# Altium project PALHASERVO.PrjPcb
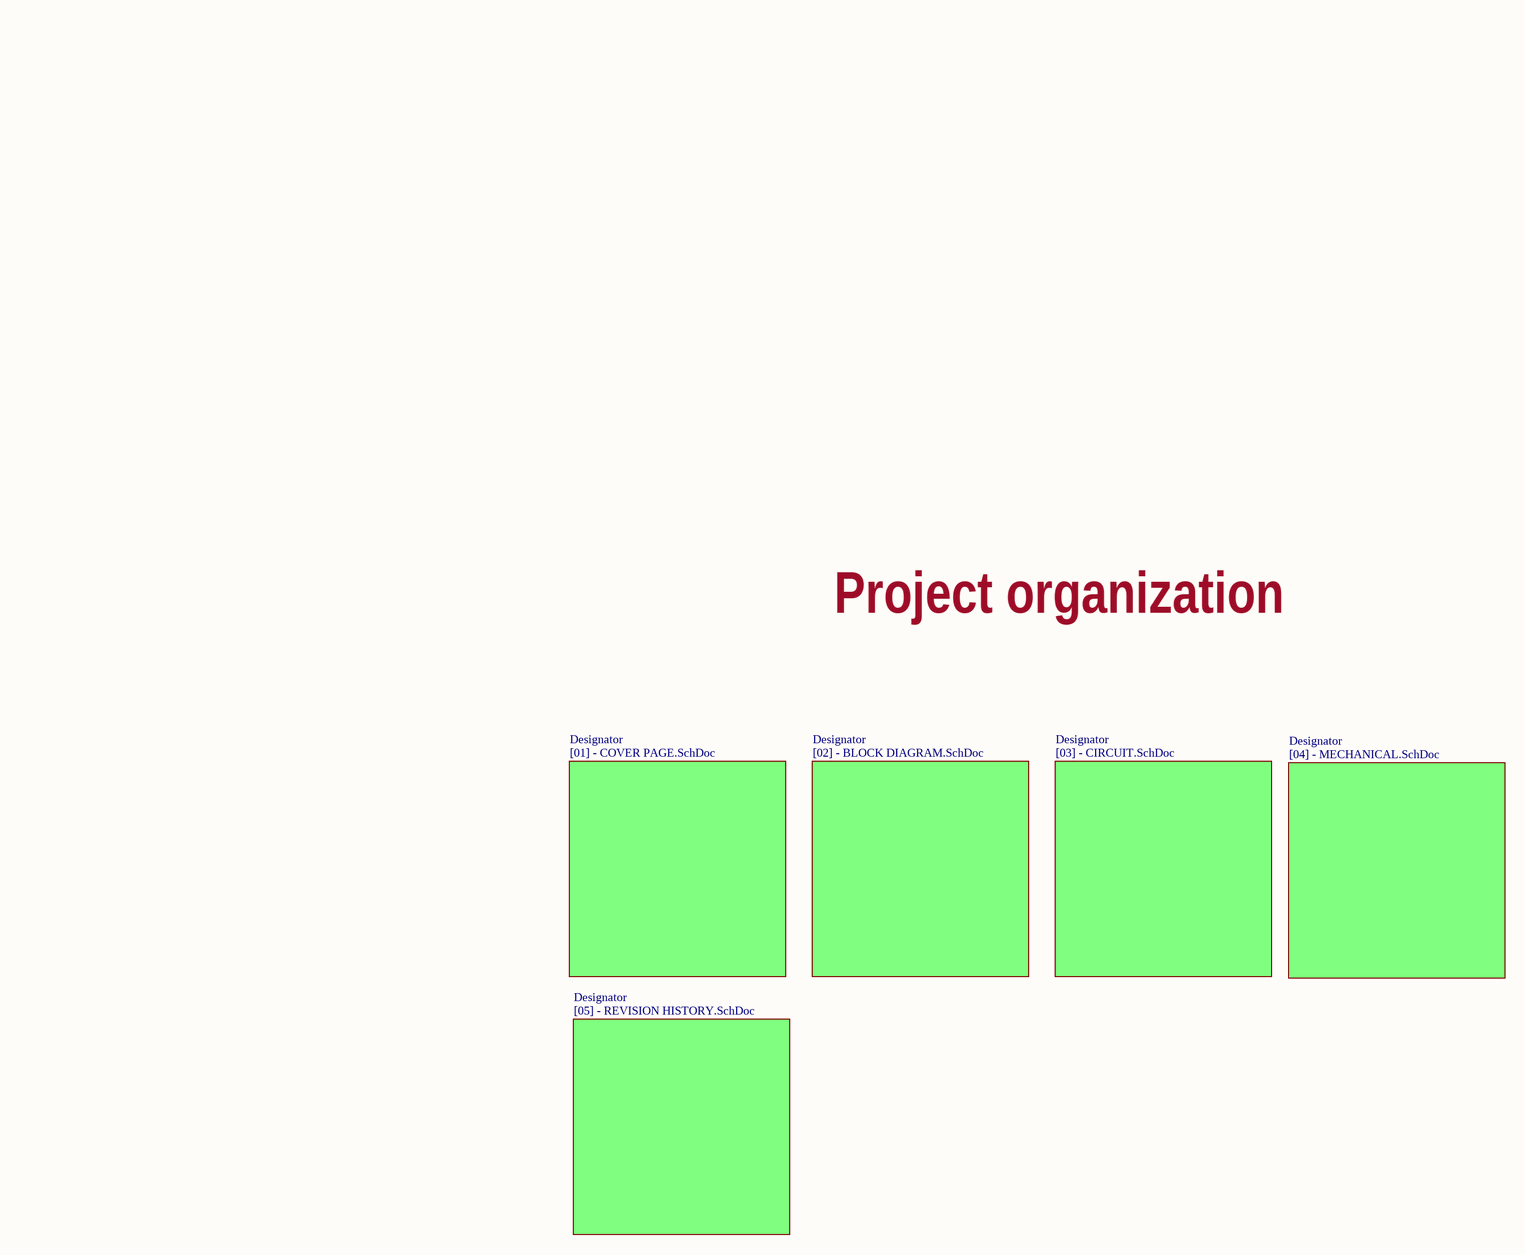
[diagram p0: PALHASERVO.SchDoc]
Assembly_Variant: Full; Currency: USD; EngineerName: Jpnbino; Project: Template Project; VersionRevision: V1I1
4 sheets, 25 parts. Net scope: global (net labels, ports and power ports of the same name join across sheets).
Board file: PALHASERVO.PcbDoc
Sheets:
  PALHASERVO.SchDoc
    Designator = [01] - COVER PAGE.SchDoc
    Designator = [03] - CIRCUIT.SchDoc
    Designator = [04] - MECHANICAL.SchDoc

## Sheet PALHASERVO.SchDoc
size A3; CompanyName: KDS; Engineer: João Paulo Nogueira Bino; Organization: KDS; DocumentNumber: 0; Revision: V1I1; SheetNumber: 0; SheetTotal: 6; PageSetup: Record=PageOptions|CenterHorizontal=True|CenterVertical=True|PrintScale=1.07|XCorrection=1.00|YCorrection=1.00|PrintKind=1|BorderSize=5000000|LeftOffset=0|BottomOffset=0|Orientation=2|PaperLength=1000|PaperWidth=1000|Scale=100|PaperSource=7|PrintQuality=600|MediaType=1|DitherType=10|PaperKind=A3|PrintScaleMode=1; ProjectName: KDS C6A816x Module

### Sub-sheets
Designator = [01] - COVER PAGE.SchDoc: no entries
Designator = [02] - BLOCK DIAGRAM.SchDoc (file not in this document): no entries
Designator = [03] - CIRCUIT.SchDoc: no entries
Designator = [04] - MECHANICAL.SchDoc: no entries
Designator = [05] - REVISION HISTORY.SchDoc (file not in this document): no entries

### Notes on the sheet
- Project organization
- Project:
- Revision:
- Engineer:
- Title:
- Embedded Things
- Date:
- Hour:
- Variant:

## Sheet [01] - COVER PAGE.SchDoc
size A3; DocumentNumber: 1; SheetNumber: 1; SheetTotal: 6
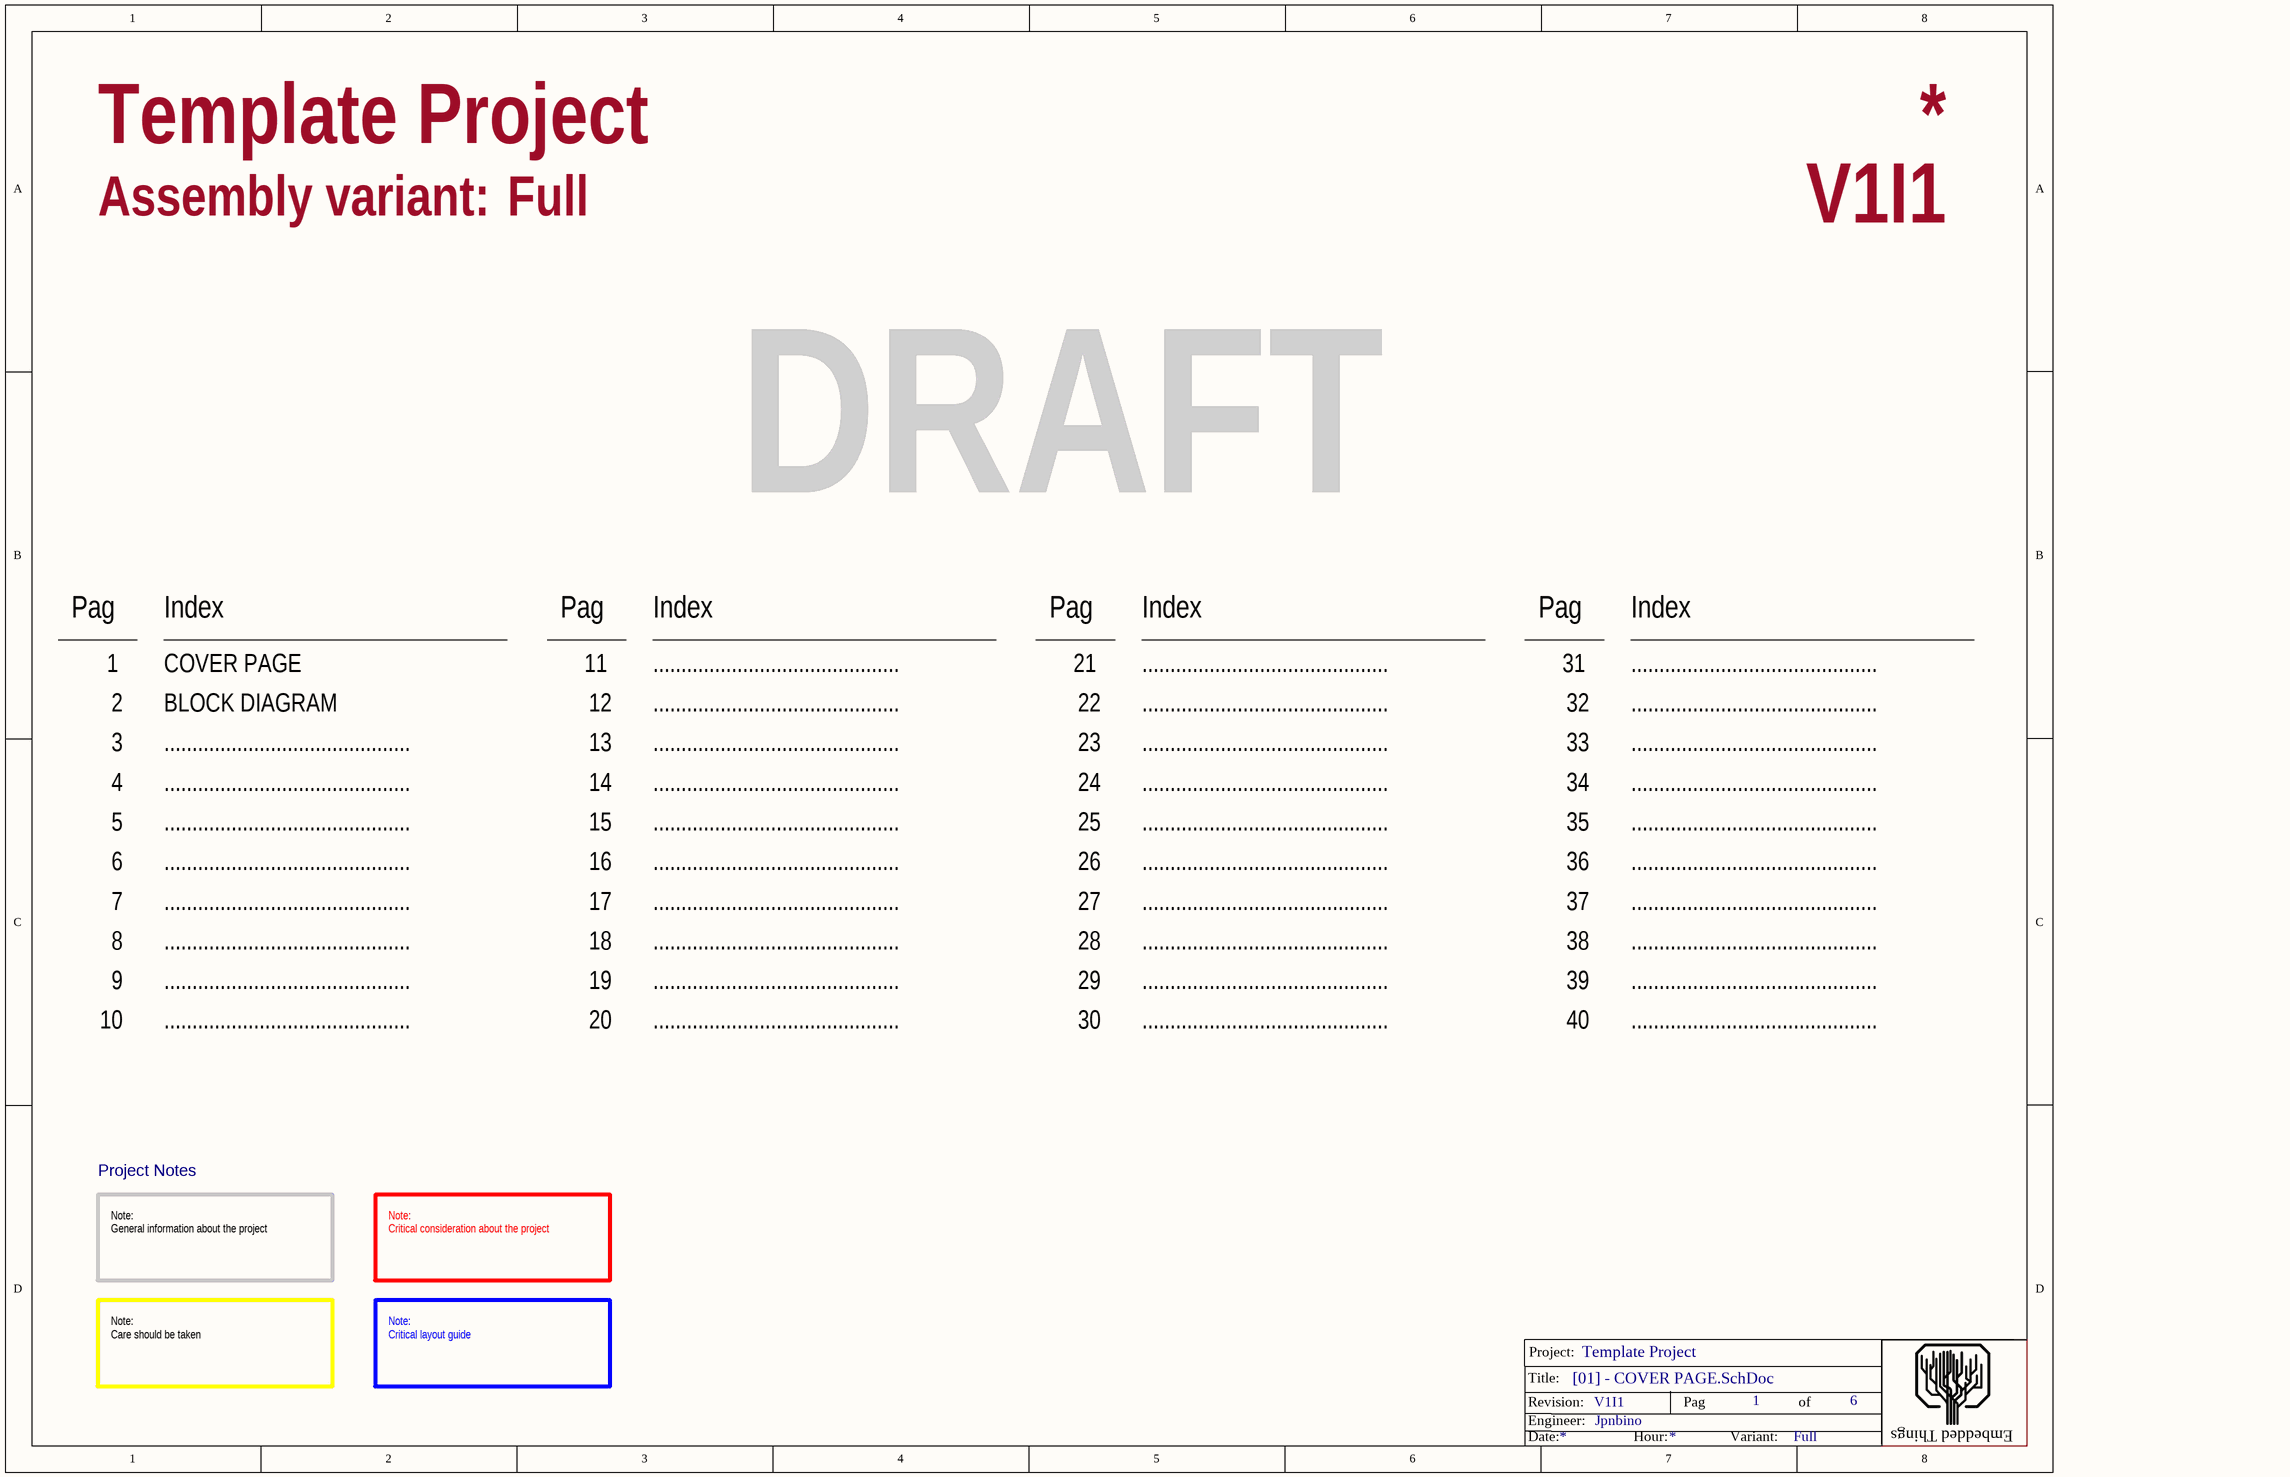
[diagram p1: [01] - COVER PAGE.SchDoc]

### Notes on the sheet
- Assembly variant:
- DRAFT
- Pag
- Index
- 1
- COVER PAGE
- 11
- ............................................
- 21
- 31
- 2
- 3
- BLOCK DIAGRAM
- 12
- 13
- 22
- 23
- 32
- 33
- 4
- 5
- 14
- 15
- 24
- 25
- 34
- 35
- 6
- 16
- 26
- 36
- 7
- 8
- 17
- 18
- 27
- 28
- 37
- 38
- 9
- 10
- 19
- 20
- 29
- 30
- 39
- 40
- Project Notes
- Note:
  General information about the project
- Note:
  Critical consideration about the project
- Note:
  Care should be taken
- Note:
  Critical layout guide
- Project:
- Revision:
- Engineer:
- Title:
- of
- Embedded Things
- Date:
- Hour:
- Variant:

## Sheet [03] - CIRCUIT.SchDoc
size A3; DocumentNumber: 3; SheetNumber: 3; SheetTotal: 6; PageSetup: Record=PageOptions|CenterHorizontal=True|CenterVertical=True|PrintScale=1.00|XCorrection=1.00|YCorrection=1.00|PrintKind=1|BorderSize=5000000|LeftOffset=0|BottomOffset=0|Orientation=2|PaperLength=1000|PaperWidth=1000|Scale=100|PaperSource=7|PrintQuality=-3|MediaType=1|DitherType=10|PrintScaleMode=1|PaperKind=A4|PaperIndex=9
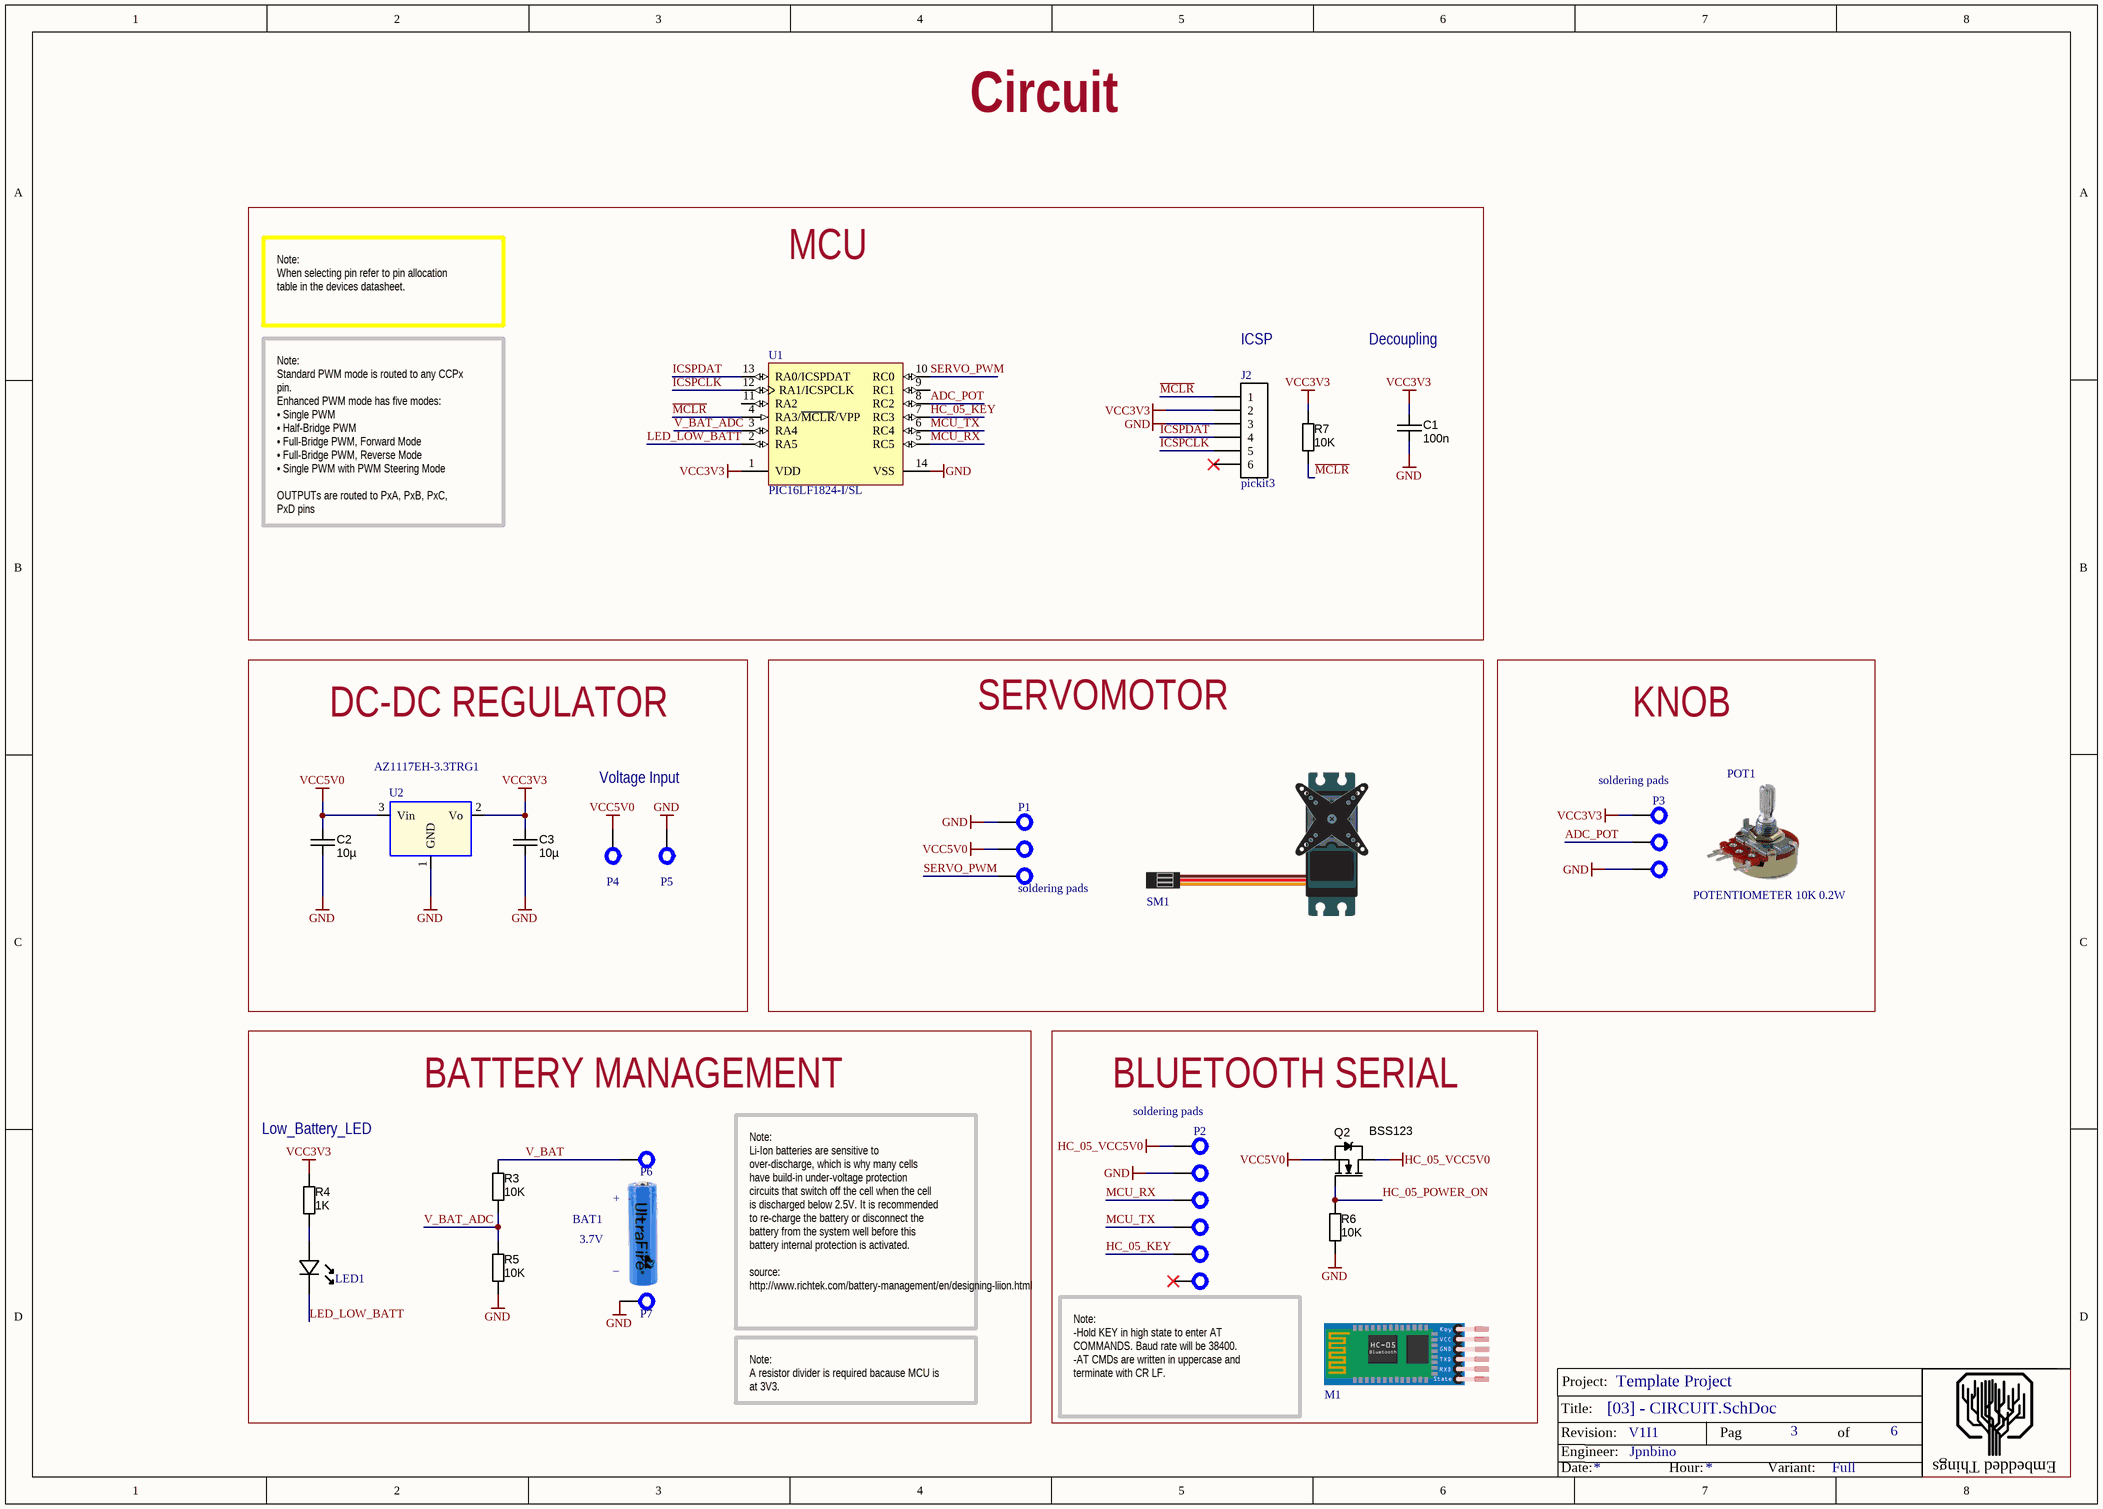
[diagram p2: [03] - CIRCUIT.SchDoc]

### Parts
BAT1  3.7V
C1  value 100n  [CAPC1608X90N]  (hidden comment: approved sub OK)
C2  value 10µ  [CAPC3216X180N]  (hidden comment: approved sub OK)
C3  value 10µ  [CAPC3216X180N]  (hidden comment: approved sub OK)
J2  pickit3  [CONN_ICSP]  (no BOM)
LED1  RED  [LED-0603-RED]  (value not drawn)
M1  MODULE HC-05  (value not drawn)
P1  type: soldering pads  [PAD_PTH 3 vias]  (hidden comment: 3)  (no BOM)
P2  type: soldering pads  [PAD_PTH 6 VIAS]  (hidden comment: 6)  (no BOM)
P3  type: soldering pads  [PAD_PTH 3 vias]  (hidden comment: 3)  (no BOM)
P4  1  [PAD_PTH]  (value not drawn)  (no BOM)
P5  1  [PAD_PTH]  (value not drawn)  (no BOM)
P6  1  [PAD_PTH]  (value not drawn)  (no BOM)
P7  1  [PAD_PTH]  (value not drawn)  (no BOM)
POT1  POTENTIOMETER 10K 0.2W
Q2  BSS123  [SOT23-3]
R3  value 10K  [RESC1608X55N]  (hidden comment: Thick Film)
R4  value 1K  [RESC1608X55N]  (hidden comment: Thick Film)
R5  value 10K  [RESC1608X55N]  (hidden comment: Thick Film)
R6  value 10K  [RESC1608X55N]  (hidden comment: Thick Film)
R7  value 10K  [RESC1608X55N]  (hidden comment: Thick Film)
SM1  SERVOMOTOR 9G  (value not drawn)
U1  PIC16LF1824-I/SL  [MCHP-SOIC-SL14_N]
U2  Manufacturer Part Number: AZ1117EH-3.3TRG1  [SOT223]  (hidden comment: 3V3, 1A)

### Blocks framed on the sheet
MCU: C1 J2 R7 U1
DC-DC REGULATOR: C2 C3 P4 P5 U2
SERVOMOTOR: P1 SM1
KNOB: P3 POT1
BATTERY MANAGEMENT: BAT1 LED1 P6 P7 R3-R5
BLUETOOTH SERIAL: M1 P2 Q2 R6

### Nets
GND: C1.1 C2.2 C3.2 J2.3 P1.1 P2.2 P3.3 P5.1 P7.1 R5.2 R6.2 U1.14(VSS) U2.1(GND)
HC_05_VCC5V0: P2.1 Q2.3(D)
VCC3V3: C1.2 C3.1 J2.2 P3.1 R4.1 R7.1 U1.1(VDD) U2.2(Vo)
VCC5V0: C2.1 P1.2 P4.1 Q2.2(S) U2.3(Vin)
ADC_POT: P3.2 U1.8(RC2)
HC_05_KEY: P2.5 U1.7(RC3)
HC_05_POWER_ON: Q2.1(G) R6.1
ICSPCLK: J2.5 U1.12(RA1/ICSPCLK)
ICSPDAT: J2.4 U1.13(RA0/ICSPDAT)
LED_LOW_BATT: LED1.K U1.2(RA5)
~{MCLR}: J2.1 R7.2 U1.4(RA3/~{MCLR}/VPP)
MCU_RX: P2.3 U1.5(RC5)
MCU_TX: P2.4 U1.6(RC4)
SERVO_PWM: P1.3 U1.10(RC0)
V_BAT: P6.1 R3.1
V_BAT_ADC: R3.2 R5.1 U1.3(RA4)
NetLED1_A: LED1.A R4.2

Not connected (* = marked no-connect by the designer): J2 6*; P2 6*; U1 9(RC1) 11(RA2); U2 4

### Notes on the sheet
- Circuit
- Note:
  When selecting pin refer to pin allocation table in the devices datasheet.
- (near J2) ICSP
- Decoupling
- Note:
  Standard PWM mode is routed to any CCPx pin.
  Enhanced PWM mode has five modes:
  • Single PWM
  • Half-Bridge PWM
  • Full-Bridge PWM, Forward Mode
  • Full-Bridge PWM, Reverse Mode
  • Single PWM with PWM Steering Mode
  OUTPUTs are routed to PxA, PxB, PxC, PxD pins
- Voltage Input
- (near R4) Low_Battery_LED
- Note:
  Li-Ion batteries are sensitive to over-discharge, which is why many cells have build-in under-voltage protection circuits that switch off the cell when the cell is discharged below 2.5V. It is recommended to re-charge the battery or disconnect the battery from the system well before this battery internal protection is activated.
  source: http://www.richtek.com/battery-management/en/designing-liion.html
- (near P2) Note:
  -Hold KEY in high state to enter AT COMMANDS. Baud rate will be 38400.
  -AT CMDs are written in uppercase and terminate with CR LF.
- (near P2) CLOCKS (CPU & PCIE)
- Note:
  A resistor divider is required bacause MCU is at 3V3.
- Project:
- Revision:
- Engineer:
- Title:
- Pag
- of
- Embedded Things
- Date:
- Hour:
- Variant:
- (in symbol Battery Li-Ion 3.7V) +; _

### Library data of the parts
BAT1 = Battery Li-Ion 3.7V: Battery Li-Ion 3.7V 14500; Chemistry type: Lithium Ion; Voltage: 3.7V; size: 14500(AA)
C1 = CAPC_100n_0603_X7R_50V_10%: Capacitor SMD Cer 100nF 10% 50V X7R 0603; Manufacturer 1: AVX Corporation; Manufacturer Part Number 1: 06035C104KAT2A; Ratings: 50V; X7R; Material: ceramic; SCDType: spec; Manufacturer 2: TDK Corporation; Manufacturer Part Number 2: C1608X7R1H104K; Package / Case: 0603 (1608 Metric); Tolerance: ±10%; Supplier 1: Digi-Key; Supplier Part Number 1: 478-5052-1-ND; ComponentLink1URL: http://www.avx.com/docs/Catalogs/cx7r.pdf; ComponentLink1Description: http://www.avx.com/docs/Catalogs/cx7r.pdf; Supplier 2: Digi-Key; Supplier Part Number 2: 445-1314-1-ND; ComponentLink2URL: http://product.tdk.com/capacitor/mlcc/en/documents/mlcc_commercial_general_en.pdf; ComponentLink2Description: http://product.tdk.com/capacitor/mlcc/en/documents/mlcc_commercial_general_en.pdf
C2 C3 = CAPC_10u_1206_25V: Capacitor SMD Cer 10uF 10% 25V X7R 1206; Ratings: 16V; X7R; Material: ceramic; SCDType: spec; Package / Case: 1206 (3216 metric); Tolerance: ±10%; Supplier 1: Digi-Key; Supplier Part Number 1: 1276-1804-1-ND
J2 = CONN PROG PICKIT3: CONN PROG PICKIT3 6VIAS; pitch_in_mm: 2.54; device: pickit3
LED1 = LED RED CLEAR 0603 SMD: Manufacturer: Lite-On Inc.; Manufacturer Part Number: LTST-C190KRKT; Lens Color: Colorless; Millicandela Rating: 99mcd; Lens Style/Size: Rectangle with Flat Top, 1.10mm x 0.80mm; Voltage - Forward (Vf) (Typ): 2V; Current - Test: 20mA; Viewing Angle: 130°; Wavelength - Dominant: 631nm; Wavelength - Peak: 639nm; Supplier 1: Digi-Key; RoHS: RoHS Compliant; Category: Optoelectronics; Stock 1: 1118453; Pricing 1: 1=0.27, 10=0.196, 25=0.1448, 100=0.1034, 250=0.07032, 500=0.06204, 1000=0.0486 (USD); Packaging: Cut Tape (CT); Color: Red; Lens Transparency: Clear; Mounting Type: Surface Mount; Features: -; Package / Case: 0603 (1608 Metric); Supplier Device Package: *; Size / Dimension: 1.60mm L x 0.80mm W; Height (Max): 0.80mm; ComponentLink1URL: http://optoelectronics.liteon.com/upload/download/DS-22-99-0151/S_110_LTST-C190KRKT.pdf; ComponentLink1Description: http://optoelectronics.liteon.com/upload/download/DS-22-99-0151/S_110_LTST-C190KRKT.pdf; Supplier Part Number 1: 160-1436-1-ND; Value: RED
M1 = MODULE HC-05: MODULE BLUETOOTH HC-05 JY-MCU; firmware: v1.06; model: JY-MCU
P1 P3 = PAD PTH 3 VIAS HOLE 1MM: PAD PTH 3 VIAS HOLE 1MM PITCH2.54MM; pitch: 2.54mm; number of vias: 3
P2 = PAD PTH 6 VIAS HOLE 1MM: PAD PTH 6 VIAS HOLE 1MM PITCH2.54MM; pitch: 2.54mm; number of vias: 6
P4-P7 = PAD PTH 1 VIA HOLE 1MM: pitch: 0; via: 1; type: solderings pas
POT1 = POTENTIOMETER 10K 0.2W: Manufacturer: TT Electronics/BI; Manufacturer Part Number: P160KN2-4QC20B10K; Tolerance: ±20%; Built in Switch: Detent; Power (Watts): 0.2W, 1/5W; Rotation: 300°; Adjustment Type: Side Adjustment; Resistive Material: Conductive Plastic; Actuator Type: Knurled and Slotted; Actuator Length: 0.787" (20.00mm); Actuator Diameter: 0.236" (6.00mm); Bushing Thread: M7 x 0.75; Supplier 1: Digi-Key; RoHS: RoHS Compliant; Category: Potentiometers, Variable Resistors; Stock 1: 4015; Pricing 1: 1=0.76, 10=0.682, 25=0.616, 50=0.594, 100=0.561, 250=0.539, 500=0.506, 1000=0.418, 5000=0.341 (USD); Packaging: Tray; Part Status: Active; Taper: Linear; Resistance (Ohms): 10k; Temperature Coefficient: -; Termination Style: PC Pins; Mounting Type: Panel Mount; ComponentLink1URL: http://www.ttelectronics.com/sites/default/files/download-files/Datasheet_RotaryPanelPot_P160series.pdf; ComponentLink1Description: http://www.ttelectronics.com/sites/default/files/download-files/Datasheet_RotaryPanelPot_P160series.pdf; Supplier Part Number 1: 987-1310-ND
Q2 = MOSFET_BSS123: MOSFET SMD N-CH 100V 170mA SOT23-3; Manufacturer 1: Diodes Inc; Manufacturer Part Number 1: BSS123-7-F; Ratings: 100V; 170mA; Material: Metal Oxide; SCDType: source; Package / Case: SOT23-3; Supplier 1: Digi-Key; Supplier Part Number 1: BSS123-FDICT-ND
R3 R5-R7 = RES_10K_0603_5%: Resistor SMD chip 10k Ohm 0.1W 5% 0603; Manufacturer 1: Yageo; Manufacturer Part Number 1: RC0603JR-0710KL; Ratings: 1/10 W; SCDType: spec; Package / Case: 0603 (1608 metric); Tolerance: ±5%; Material: Thick Film; Supplier 1: Digi-Key; Supplier Part Number 1: 311-10KGRCT-ND; Supplier 2: Digi-Key; Supplier Part Number 2: 541-10KGCT-ND; Manufacturer 2: Vishay Dale; Manufacturer Part Number 2: CRCW060310K0JNEA; ComponentLink2URL: http://www.vishay.com/doc?20035; ComponentLink2Description: http://www.vishay.com/doc?20035; ComponentLink1URL: http://www.yageo.com/documents/recent/PYu-RC0603_51_RoHS_L_4.pdf; ComponentLink1Description: http://www.yageo.com/documents/recent/PYu-RC0603_51_RoHS_L_4.pdf
R4 = RES_1K_0603_5%: Resistor SMD chip 1k Ohm 0.1W 5% 0603; Manufacturer 1: Yageo; Manufacturer Part Number 1: RC0603JR-071KL; Ratings: 1/10 W; SCDType: spec; Package / Case: 0603 (1608 metric); Tolerance: ±5%; Material: Thick Film; Supplier 1: Digi-Key; Supplier Part Number 1: 311-1.0KGRCT-ND; Supplier 2: Digi-Key; Supplier Part Number 2: 541-1.0KGCT-ND; Manufacturer 2: Vishay Dale; Manufacturer Part Number 2: CRCW06031K00JNEA; ComponentLink2URL: http://www.vishay.com/doc?20008; ComponentLink2Description: http://www.vishay.com/doc?20008; ComponentLink1URL: http://www.yageo.com/documents/recent/PYu-RC0603_51_RoHS_L_4.pdf; ComponentLink1Description: http://www.yageo.com/documents/recent/PYu-RC0603_51_RoHS_L_4.pdf
U1 = PIC16LF1824-I/SL: Flash Microcontroller with XLP Technology, 32 MHz, 11 I/O, -40 to 85 degC, 14-pin SOIC (SL14), Tube; Manufacturer: Microchip; # of A/D Channels: 8; Digital Communication: 1 -A/E/USART, 1 -MSSP(SPI/I2C); EEPROM Data Memory (bytes): 256; I/O Pins: 11; Internal Oscillator: 32 MHz, 31 kHz; Max. CPU Speed MHz: 32; Operation Voltage Range: 1.8V - 3.6V; Program Memory KBytes: 7; Program Memory KWords: 4; Timers: 4 - 8-bit, 1 - 16-bit, 0 - 32-bit; DatasheetVersion: Rev. D; PackageVersion: C04-065C, 12/2012; PackageReference: SOIC-SL14; PackageDescription: 14-Lead Plastic Small Outline, 8.65 x 3.9 mm Body, 1.27 mm Pitch; Supplier 1: Digi-Key; Supplier Part Number 1: PIC16LF1824-I/SL-ND; Supplier 2: Farnell; Supplier Part Number 2: 1814949; Supplier 3: Newark; Supplier Part Number 3: 65R5973; Supplier 4: Mouser; Supplier Part Number 4: 579-PIC16LF1824ISL; Memory Type: Flash; Packing: TUBE; RAM: 256; Mounting Technology: Surface Mount; PartNumber: PIC16LF1824-I/SL; ComponentLink1Description: Datasheet; ComponentLink1URL: http://ww1.microchip.com/downloads/en/DeviceDoc/41419D.pdf; ComponentLink2Description: Package Specification; ComponentLink2URL: http://www.microchip.com/stellent/groups/techpub_sg/documents/packagingspec/en012702.pdf; ComponentLink3Description: URL Link1; ComponentLink3URL: Product URL:http://www.microchip.com/datasheet/PIC16F1824
U2 = REG AZ1117CR-33: IC REG LDO 3.3V 1A SOT223; Manufacturer: Diodes Incorporated; Regulator Topology: Positive Fixed; Voltage - Dropout (Typical): 1.1V @ 1A; Number of Regulators: 1; Voltage - Input: Up to 13V; Supplier 1: Digi-Key; RoHS: RoHS Compliant; Category: Integrated Circuits (ICs); Stock 1: 9901; Pricing 1: 1=0.43, 10=0.321, 100=0.1813, 500=0.1202, 1000=0.09219 (USD); Packaging: Digi-Reel®; Voltage - Output: 3.3V; Current - Output: 1A; Current - Limit (Min): -; Operating Temperature: -40°C ~ 125°C; Mounting Type: Surface Mount; Package / Case: TO-261-4, TO-261AA; Supplier Device Package: SOT-223; ComponentLink1URL: http://www.diodes.com/_files/datasheets/AZ1117E.pdf; ComponentLink1Description: http://www.diodes.com/_files/datasheets/AZ1117E.pdf; Supplier Part Number 1: AZ1117EH-3.3TRG1DIDKR-ND; Value: 3V3, 1A

## Sheet [04] - MECHANICAL.SchDoc
size A4; DocumentNumber: 4; SheetNumber: 4; SheetTotal: 6
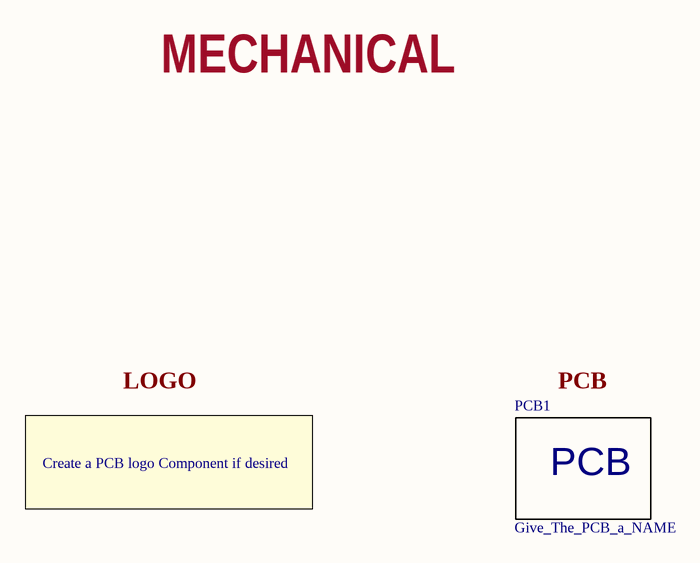
[diagram p3: [04] - MECHANICAL.SchDoc]

### Parts
PCB1  Give_The_PCB_a_NAME

### Notes on the sheet
- MECHANICAL
- LOGO
- PCB
- Create a PCB logo Component if desired
- Project:
- Revision:
- Engineer:
- Title:
- Page
- of
- Embedded Things
- Date:
- Hour:
- Variant:

### Library data of the parts
PCB1 = PCB: Printed Circuit Board; Category: Printed Circuit Board